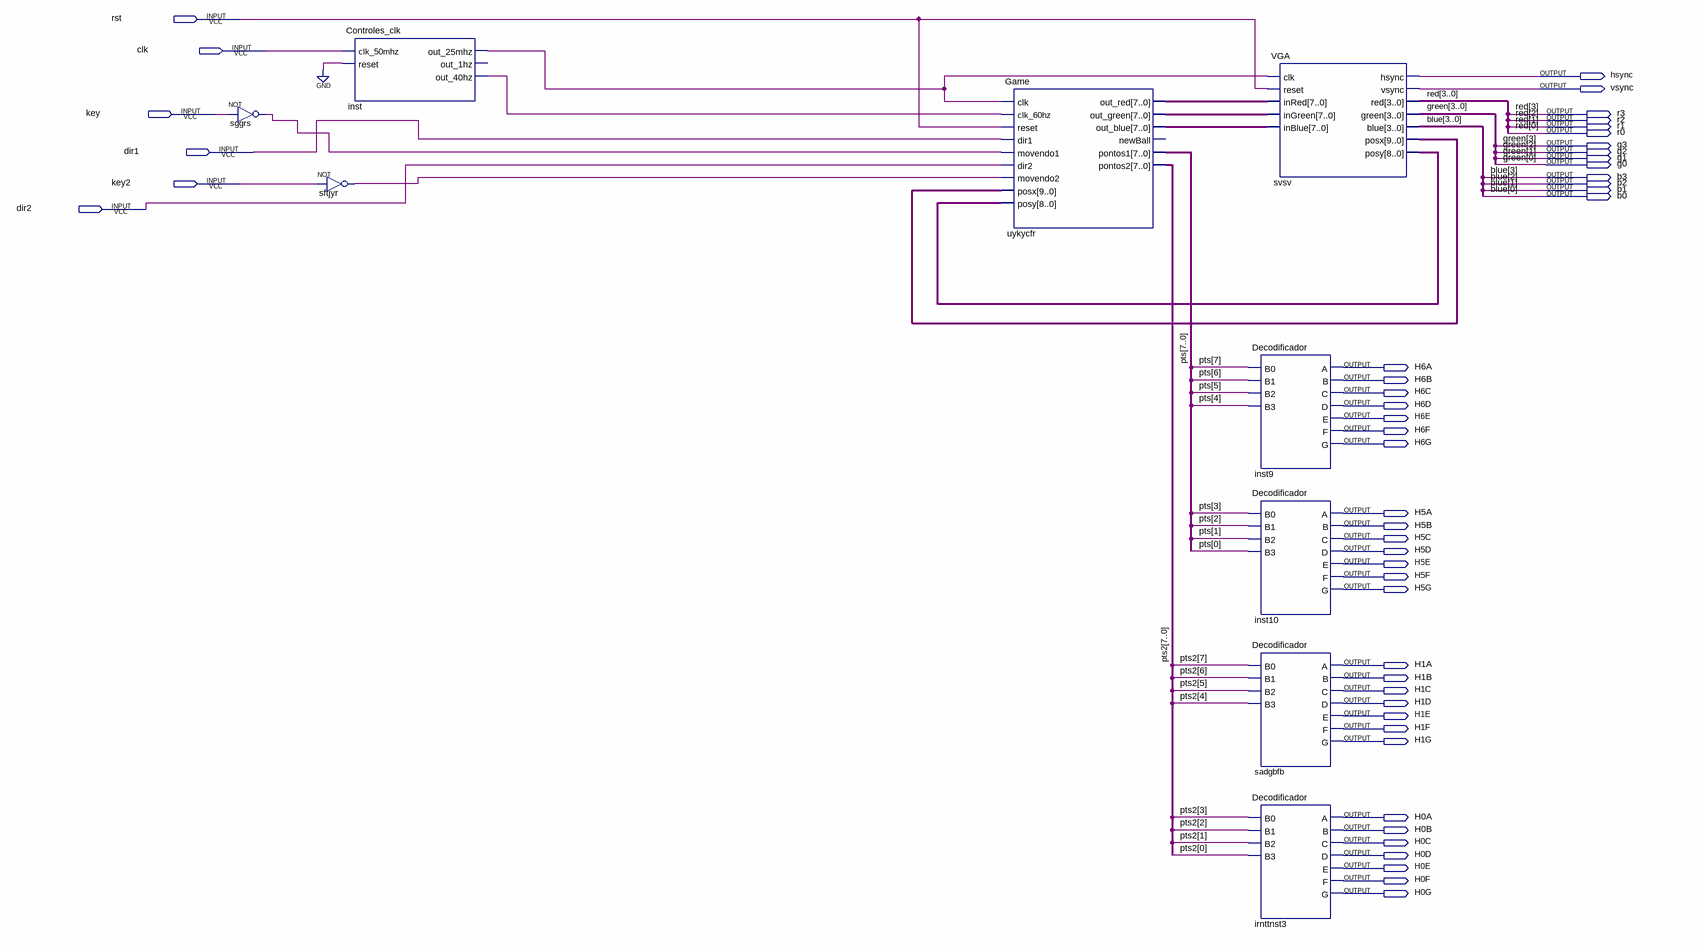
[diagram p0: schematic sheet]
// Quartus schematic Jogo.bdf as structural Verilog: 9 symbols, 48 pins
module Jogo (
  input  rst,
  input  clk,
  input  key,
  input  dir1,
  input  key2,
  input  dir2,
  output hsync,
  output vsync,
  output r3,
  output r2,
  output r1,
  output r0,
  output g3,
  output g2,
  output g1,
  output g0,
  output b3,
  output b2,
  output b1,
  output b0,
  output H6A,
  output H6B,
  output H6C,
  output H6D,
  output H6E,
  output H6F,
  output H6G,
  output H5A,
  output H5B,
  output H5C,
  output H5D,
  output H5E,
  output H5F,
  output H5G,
  output H1A,
  output H1B,
  output H1C,
  output H1D,
  output H1E,
  output H1F,
  output H1G,
  output H0A,
  output H0B,
  output H0C,
  output H0D,
  output H0E,
  output H0F,
  output H0G
);

  wire inst_out_25mhz, inst_out_40hz, sftjyr_out, sggrs_out;
  wire [7:0] pts, pts2, uykycfr_out_blue, uykycfr_out_green, uykycfr_out_red;
  wire [8:0] svsv_posy;
  wire [9:0] svsv_posx;

  not sggrs (sggrs_out, key);
  Controles_clk inst (
    .clk_50mhz(clk), .reset(1'b0), .out_25mhz(inst_out_25mhz), .out_40hz(inst_out_40hz));  // open: out_1hz
  not sftjyr (sftjyr_out, key2);
  Game uykycfr (
    .clk(inst_out_25mhz), .clk_60hz(inst_out_40hz), .reset(rst), .dir1(dir1), .movendo1(sggrs_out),
    .dir2(dir2), .movendo2(sftjyr_out), .posx(svsv_posx), .posy(svsv_posy), .out_red(uykycfr_out_red),
    .out_green(uykycfr_out_green), .out_blue(uykycfr_out_blue), .pontos1(pts), .pontos2(pts2));  // open: newBall
  Decodificador inst9 (
    .B0(pts[7]), .B1(pts[6]), .B2(pts[5]), .B3(pts[4]), .A(H6A), .B(H6B), .C(H6C), .D(H6D), .E(H6E), .F(H6F),
    .G(H6G));
  Decodificador inst10 (
    .B0(pts[3]), .B1(pts[2]), .B2(pts[1]), .B3(pts[0]), .A(H5A), .B(H5B), .C(H5C), .D(H5D), .E(H5E), .F(H5F),
    .G(H5G));
  Decodificador sadgbfb (
    .B0(pts2[7]), .B1(pts2[6]), .B2(pts2[5]), .B3(pts2[4]), .A(H1A), .B(H1B), .C(H1C), .D(H1D), .E(H1E),
    .F(H1F), .G(H1G));
  Decodificador irnttnst3 (
    .B0(pts2[3]), .B1(pts2[2]), .B2(pts2[1]), .B3(pts2[0]), .A(H0A), .B(H0B), .C(H0C), .D(H0D), .E(H0E),
    .F(H0F), .G(H0G));
  VGA svsv (
    .clk(inst_out_25mhz), .reset(rst), .inRed(uykycfr_out_red), .inGreen(uykycfr_out_green),
    .inBlue(uykycfr_out_blue), .hsync(hsync), .vsync(vsync), .red({r3, r2, r1, r0}),
    .green({g3, g2, g1, g0}), .blue({b3, b2, b1, b0}), .posx(svsv_posx), .posy(svsv_posy));

  // Other names for the same wires on the sheet: blue[3:0] = {b3, b2, b1, b0}; green[3:0] = {g3, g2, g1, g0};
  //   red[3:0] = {r3, r2, r1, r0}
endmodule
